# EAGLE design untitled (EAGLE 9.6.2)
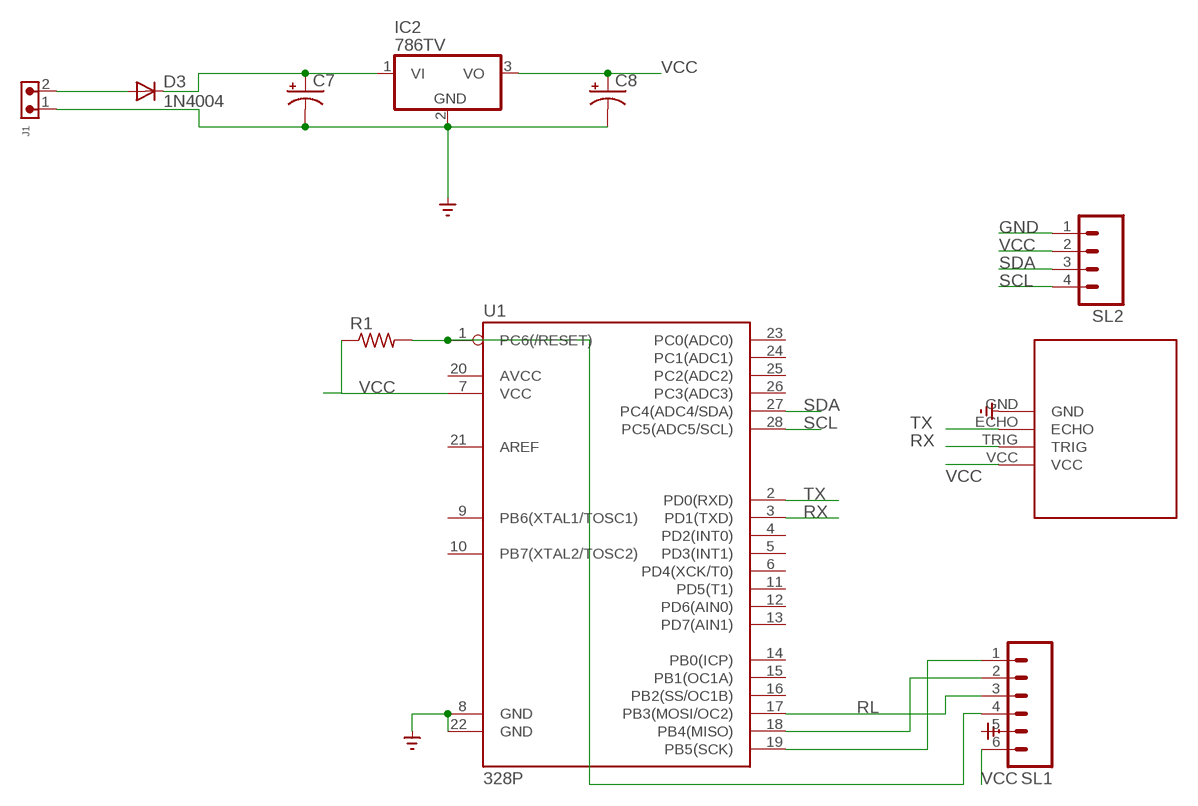
[diagram p0: schematic, sheet 1]

## Parts
C7  CAPACITOR-PE5-10.5  [E5-10,5]
C8  CAPACITOR-PE5-6  [E5-6]
D3  1N4004  [DO41-10]
IC2  786TV  [TO220V]
J1  691305530002  [691305530002]
R1  R-US_0207/7  [0207/7]
SL1  M06  [06P]
SL2  M04  [04P]
U1  328P  ATMEGA328P_PDIP  [DIP28]
U$6  SRO4M  [SRO4M]

## Nets
GND: C7.- C8.- IC2.2(GND) J1.1 SL1.5 SL2.1 U1.8(GND) U1.22(GND) U$6.GND ; supply symbol labelled SUPPLY_BRASTAN_GND_
N$1: D3.A J1.2
N$3: SL1.1 U1.19(PB5(SCK))
N$4: SL1.2 U1.18(PB4(MISO))
N$6: R1.2 SL1.4 U1.1(PC6(/RESET))
PWR: C7.+ D3.C IC2.1(VI)
RL: SL1.3 U1.17(PB3(MOSI/OC2))
RX: U1.3(PD1(TXD)) U$6.TRIG
SCL: SL2.4 U1.28(PC5(ADC5/SCL))
SDA: SL2.3 U1.27(PC4(ADC4/SDA))
TX: U1.2(PD0(RXD)) U$6.ECHO
VCC: C8.+ IC2.3(VO) R1.1 SL1.6 SL2.2 U1.7(VCC) U$6.VCC
Unconnected: U1.4(PD2(INT0)) U1.5(PD3(INT1)) U1.6(PD4(XCK/T0)) U1.9(PB6(XTAL1/TOSC1)) U1.10(PB7(XTAL2/TOSC2)) U1.11(PD5(T1)) U1.12(PD6(AIN0)) U1.13(PD7(AIN1)) U1.14(PB0(ICP)) U1.15(PB1(OC1A)) U1.16(PB2(SS/OC1B)) U1.20(AVCC) U1.21(AREF) U1.23(PC0(ADC0)) U1.24(PC1(ADC1)) U1.25(PC2(ADC2)) U1.26(PC3(ADC3))

## Library data of the parts
C7 C8 = BeagleBone_Blue_R3:CAPACITOR-P: POLARIZED CAPACITOR, American symbol
D3 = adafruit:1N4004: DIODE General purpose 1N400x type rectifier (With bigger pads) http://www.ladyada.net/library/pcb/eaglelibrary.html
IC2 = linear:78*: Positive VOLTAGE REGULATOR Source: http://cache.national.com/ds/LM/LM78L05.pdf http://www.fairchildsemi.com/ds/LM/LM7805.pdf
J1 = Wurth_Connectors_WR-TBL Pluggable Connector:691305530002: WR-TBL Serie 3055 - 5,08 mm - PCB Header Vertical Entry with Plastic Latches KIND PROPERTIES Pitch 5.08 mm MATERIAL PROPERTIES Insulator Material PA66 Insulator Flammability Rating UL94 V-0 Insulator Color Green Terminal Material Copper Alloy Terminal Plating Tin-plated surface GENERAL INFORMATION Operating Temperature -40 up to +105 °C ELECTRICAL PROPERTIES IR UL 16 A Working Voltage [UL] 300 V (AC) Withstanding Voltage [UL] 2500 V (AC) Contact Resistance [UL] 20 mΩ CERTIFICATION UL Approval E315414 <https://www.we-online.com/catalog/media/o135349v209%20Family_WR-TBL3_6913055300xx.jpg> Details see: https://www.we-online.com/catalog/en/TBL_5_08_3055_6913055300XX/ Updated by Ella Wu 2019-12-30 2019(C) Wurth Elektronik; DATASHEET-URL: https://www.we-online.com/catalog/datasheet/691305530002.pdf; IR-UL: 16A; MOUNT: THT; PART-NUMBER: 691305530002; PINS: 2; PITCH: 5.08mm; TYPE: Vertical; WORKING-VOLTAGE-UL: 300V (AC)
R1 = adafruit:R-US_: RESISTOR, American symbol
SL1 = con-amp-quick:M06: AMP QUICK CONNECTOR; OC_FARNELL: unknown; OC_NEWARK: unknown
SL2 = con-amp-quick:M04: AMP QUICK CONNECTOR; OC_FARNELL: unknown; OC_NEWARK: unknown
U1 = SparkFun-IC-Microcontroller:ATMEGA328P_PDIP: Atmel 328P Through hole ATMEGA328P uC used in the Arduino 32kb flash, 1k EEPROM, 2k SRAM Datasheet <http://www.sparkfun.com/datasheets/Components/SMD/ATMega328.pdf> SparkFun Products Storefront component: AVR 28 Pin 20MHz 32K 6A/D - ATMega328P <https://www.sparkfun.com/products/9061> (COM-09061) SparkFun Simon Says - Through-Hole Soldering Kit <https://www.sparkfun.com/products/10547> (KIT-10547) SparkFun Learn to Solder - Simon Says <https://www.sparkfun.com/products/13708> (KIT-13708) SparkFun BigTime Watch Kit <https://www.sparkfun.com/products/11734> (KIT-11734) SparkFun ClockIt <https://www.sparkfun.com/products/10930> (KIT-10930) SparkFun Serial Enabled LCD Kit <https://www.sparkfun.com/products/10097> (LCD-10097) SparkFun Simon Tilts - Through Hole Soldering Kit <https://www.sparkfun.com/products/12634> (KIT-12634) SparkFun Frequency Counter Kit <https://www.sparkfun.com/products/10140> (KIT-10140) FabFM Radio Kit <https://www.sparkfun.com/products/11043> (KIT-11043) SparkFun Binary Blaster Kit <https://www.sparkfun.com/products/12037> (KIT-12037) SparkFun Metro-Gnome <https://www.sparkfun.com/products/9236> (KIT-09236) ATmega328 with Arduino Optiboot (Uno) <https://www.sparkfun.com/products/10524> (DEV-10524); PROD_ID: IC-09136
U$6 = SRO4M:SRO4M

## Board
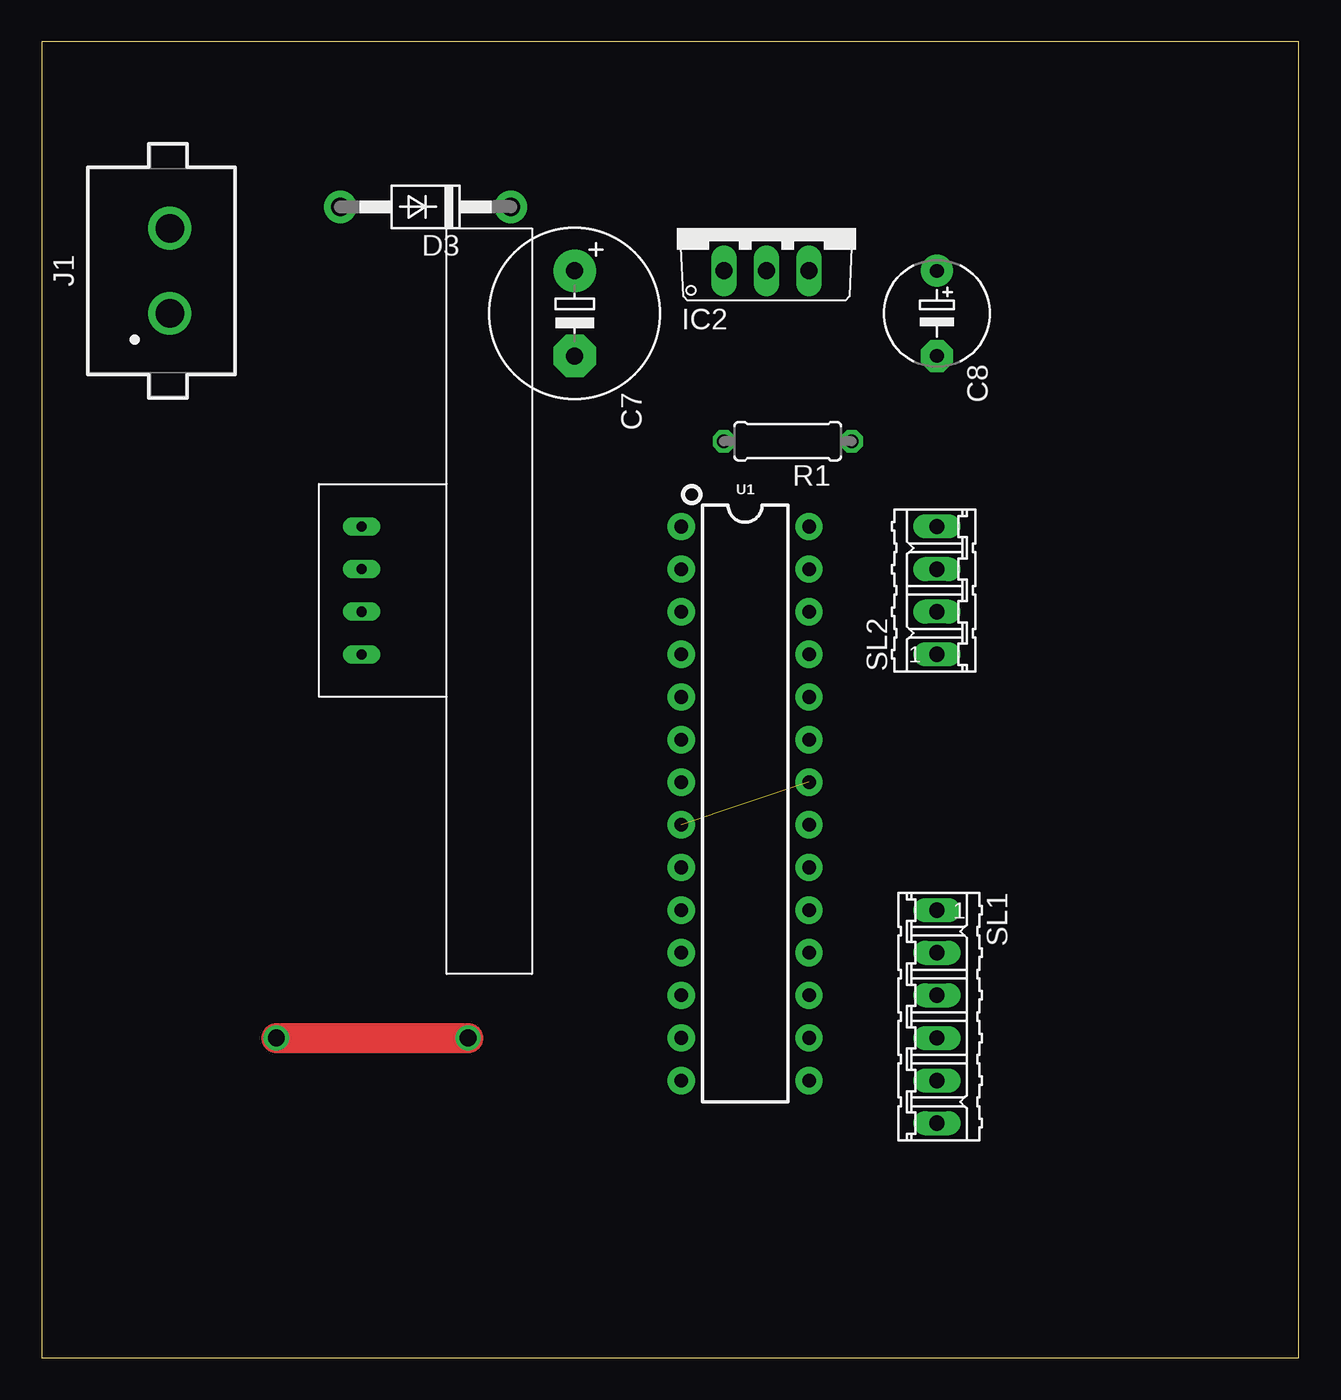
[diagram p1: board, top side]
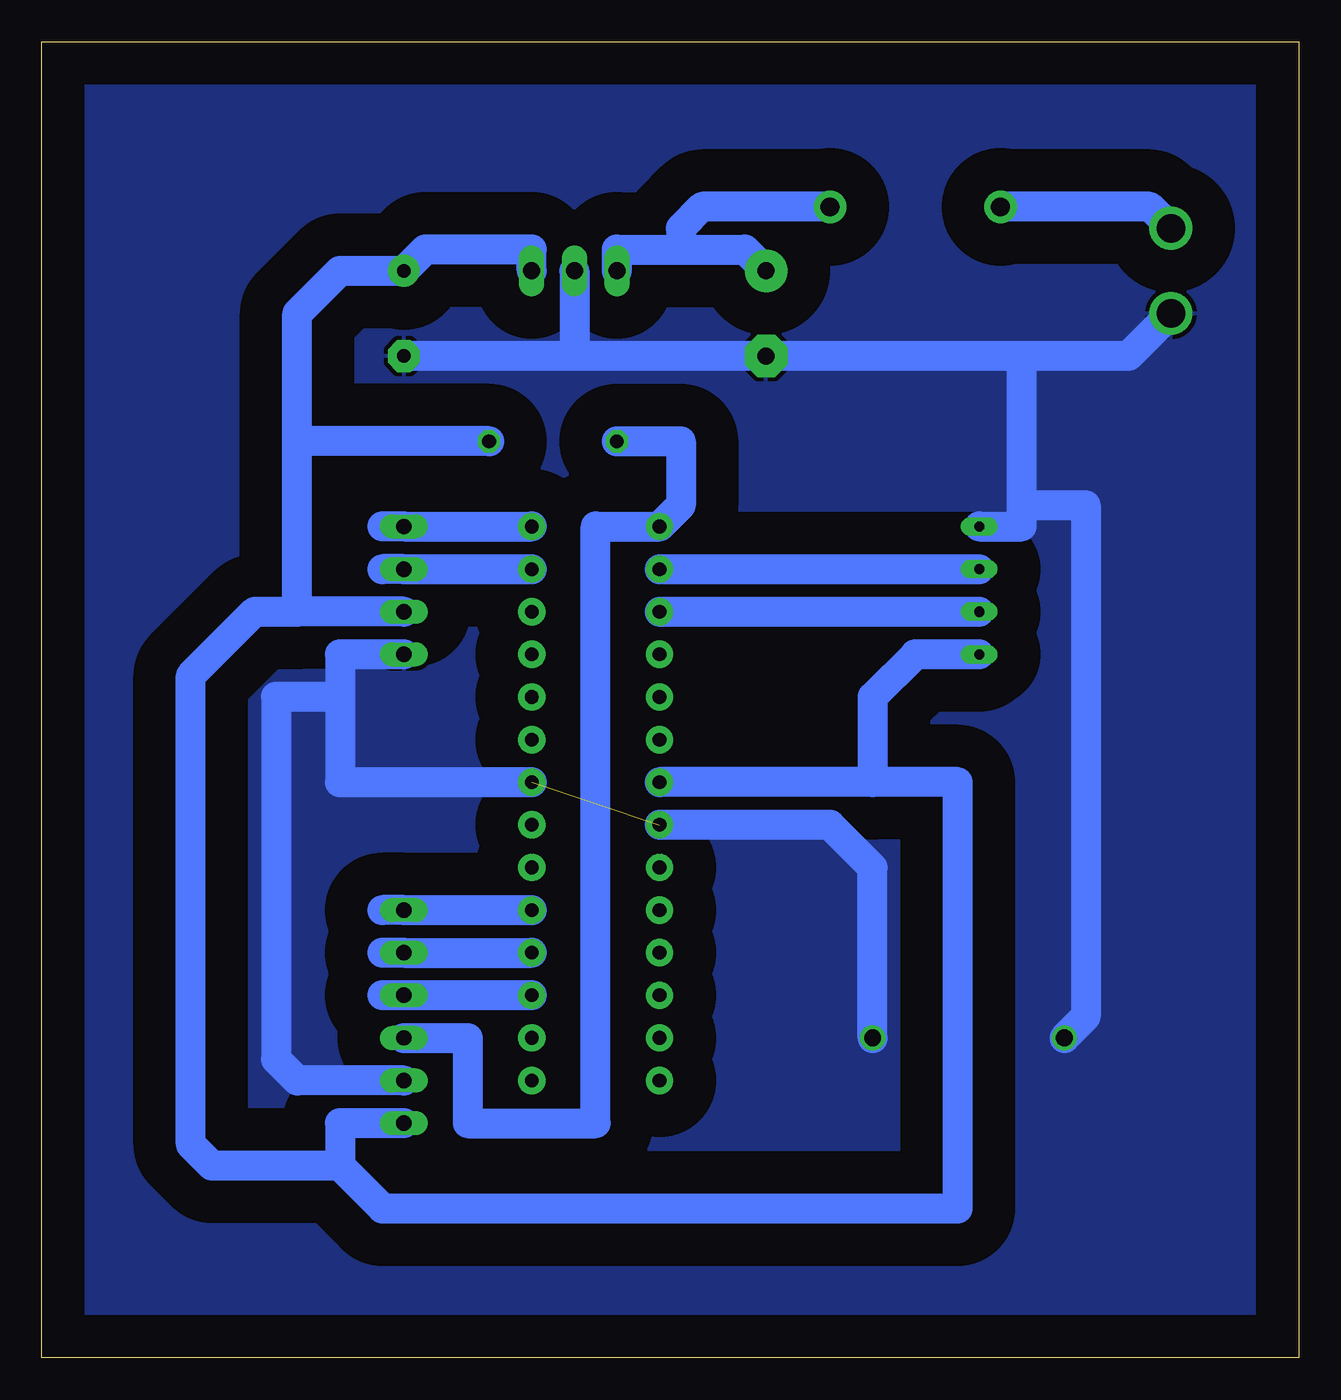
[diagram p2: board, bottom side, seen from below]

Size 74.91 x 78.41 mm. Coordinates in mm from the lower left corner, seen from the top.
Outline: 0,0 74.91,0 74.91,78.41 0,78.41 0,0
Copper layers (1*16): Top 0.035mm / dielectric 1.5mm / Bottom 0.035mm
Design rules "default *": minimum track width 6mil, minimum drill 0.35mm, track to track 30mil, track to pad 30mil, pad to pad 30mil, via to via 30mil, smd to smd 6mil, copper to edge 40mil, drill to drill 6mil, minimum pad ring 10mil, minimum via ring 8mil, stop-mask expansion 4mil, vias tented up to drill 0mil, thermal gap 10mil

### Footprints (pad centres in the part's own frame; a part is rotated, then mirrored left to right if it is on the bottom)
E5-10,5 = drill 1.016 pad 2.54: + -2.54,0 | drill 1.016 pad 2.54 octagon: - 2.54,0
E5-6 = drill 0.813 pad 1.905: + -2.54,0 | drill 0.813 pad 1.905 octagon: - 2.54,0
DO41-10 = drill 1.118 pad 1.93: A 5.08,0; C -5.08,0
TO220V = drill 1.016 long: 1 -2.54,-2.54; 2 0,-2.54; 3 2.54,-2.54
691305530002 = drill 1.7: 1 -2.54,0; 2 2.54,0
0207/7 = drill 0.813 octagon: 1 -3.81,0; 2 3.81,0
06P = drill 0.914 long: 1 -6.35,0; 2 -3.81,0; 3 -1.27,0; 4 1.27,0; 5 3.81,0; 6 6.35,0
04P = drill 0.914 long: 1 -3.81,0; 2 -1.27,0; 3 1.27,0; 4 3.81,0
DIP28 = drill 0.813 pad 1.626: 1 -16.51,-3.81; 2 -13.97,-3.81; 3 -11.43,-3.81; 4 -8.89,-3.81; 5 -6.35,-3.81; 6 -3.81,-3.81; 7 -1.27,-3.81; 8 1.27,-3.81; 9 3.81,-3.81; 10 6.35,-3.81; 11 8.89,-3.81; 12 11.43,-3.81; 13 13.97,-3.81; 14 16.51,-3.81; 15 16.51,3.81; 16 13.97,3.81; 17 11.43,3.81; 18 8.89,3.81; 19 6.35,3.81; 20 3.81,3.81; 21 1.27,3.81; 22 -1.27,3.81; 23 -3.81,3.81; 24 -6.35,3.81; 25 -8.89,3.81; 26 -11.43,3.81; 27 -13.97,3.81; 28 -16.51,3.81
SRO4M = drill 0.6 long: ECHO 7.62,-1.27; GND 7.62,-3.81; TRIG 7.62,1.27; VCC 7.62,3.81

### Placement (x,y rotation side)
C7  31.75,62.23 270 top
C8  53.34,62.23 270 top
D3  22.86,68.58 180 top
IC2  43.18,67.31 0 top
J1  7.62,64.77 90 top
R1  44.45,54.61 180 top
SL1  53.34,20.32 270 top
SL2  53.34,45.72 90 top
U1  41.91,33.02 270 top
U$6  26.67,45.72 180 top

### Tracks (layer width: path | path; a pad name or v marks a point on that pad's centre or on a via)
GND  (via drill 1)  (1 unrouted)
  Top 1.778: v13.97,19.05 v25.4,19.05
  Bottom 1.778: SL2.1 57.15,41.91 57.15,39.37 | 57.15,39.37 57.15,34.29 U1.22 | IC2.2 43.18,59.69 | 43.18,59.69 C8.- | 43.18,59.69 C7.- 16.51,59.69 | SL1.5 59.69,16.51 60.96,17.78 60.96,39.37 57.15,39.37 | J1.1 10.16,59.69 16.51,59.69 | U$6.GND 16.51,49.53 16.51,50.8 | 16.51,50.8 16.51,59.69 | 16.51,50.8 12.7,50.8 12.7,20.32 v13.97,19.05 | v25.4,19.05 25.4,29.21 27.94,31.75 U1.8
  pour Bottom (isolate 2.54): 0,0 74.93,0 74.93,78.74 0,78.74
N$1
  Bottom 1.778: J1.2 8.89,68.58 D3.A
N$3
  Bottom 1.778: U1.19 SL1.1 54.61,26.67
N$4
  Bottom 1.778: U1.18 SL1.2 54.61,24.13
N$6
  Bottom 1.778: SL1.4 49.53,19.05 49.53,13.97 41.91,13.97 41.91,49.53 U1.1 36.83,50.8 36.83,54.61 R1.2
PWR
  Bottom 1.778: IC2.1 40.64,66.04 36.83,66.04 | C7.+ 33.02,66.04 36.83,66.04 | D3.C 35.56,68.58 36.83,67.31 36.83,66.04
RL
  Bottom 1.778: U1.17 SL1.3 54.61,21.59
RX
  Bottom 1.778: U1.3 U$6.TRIG
SCL
  Bottom 1.778: U1.28 SL2.4 54.61,49.53
SDA
  Bottom 1.778: U1.27 SL2.3 54.61,46.99
TX
  Bottom 1.778: U1.2 U$6.ECHO
VCC
  Bottom 1.778: SL2.2 59.69,44.45 | 59.69,44.45 59.69,54.61 | 59.69,54.61 59.69,62.23 57.15,64.77 C8.+ 52.07,66.04 45.72,66.04 IC2.3 | SL1.6 57.15,13.97 57.15,11.43 | 57.15,11.43 54.61,8.89 20.32,8.89 20.32,34.29 25.4,34.29 | 25.4,34.29 U1.7 | 57.15,11.43 64.77,11.43 66.04,12.7 66.04,40.64 62.23,44.45 59.69,44.45 | U$6.VCC 22.86,41.91 25.4,39.37 25.4,34.29 | R1.1 59.69,54.61